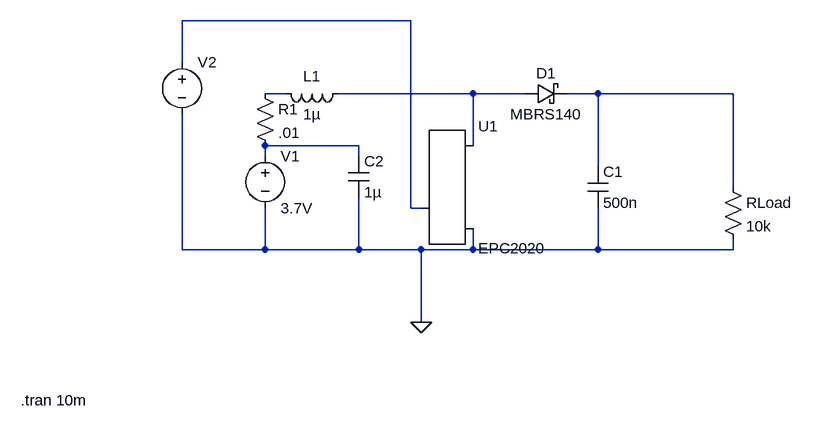
[diagram p0: schematic EPC2020-Boost.asc]
EPC2020-Boost.asc, the LTspice schematic file:
Version 4
SHEET 1 880 680
WIRE 80 -48 -272 -48
WIRE -272 16 -272 -48
WIRE -112 64 -144 64
WIRE 176 64 -32 64
WIRE 256 64 176 64
WIRE 368 64 320 64
WIRE 576 64 368 64
WIRE 0 144 -144 144
WIRE 176 144 176 64
WIRE -144 160 -144 144
WIRE 0 160 0 144
WIRE 368 176 368 64
WIRE 576 208 576 64
WIRE 80 240 80 -48
WIRE 96 240 80 240
WIRE -272 304 -272 96
WIRE -144 304 -144 240
WIRE -144 304 -272 304
WIRE 0 304 0 224
WIRE 0 304 -144 304
WIRE 96 304 0 304
WIRE 176 304 176 272
WIRE 176 304 96 304
WIRE 368 304 368 240
WIRE 368 304 176 304
WIRE 576 304 576 288
WIRE 576 304 368 304
WIRE 96 416 96 304
FLAG 96 416 0
SYMBOL cap 352 176 R0
SYMATTR InstName C1
SYMATTR Value 500n
SYMBOL cap -16 160 R0
SYMATTR InstName C2
SYMATTR Value 1µ
SYMBOL EPCGaN 96 240 R0
SYMATTR InstName U1
SYMATTR Value EPC2020
SYMBOL voltage -144 144 R0
WINDOW 123 0 0 Left 0
WINDOW 39 0 0 Left 0
SYMATTR InstName V1
SYMATTR Value 3.7V
SYMBOL ind -16 48 R90
WINDOW 0 5 56 VBottom 2
WINDOW 3 32 56 VTop 2
SYMATTR InstName L1
SYMATTR Value 1µ
SYMBOL schottky 256 80 R270
WINDOW 0 32 32 VTop 2
WINDOW 3 0 32 VBottom 2
SYMATTR InstName D1
SYMATTR Value MBRS140
SYMATTR Description Diode
SYMATTR Type diode
SYMBOL voltage -272 0 R0
WINDOW 123 0 0 Left 0
WINDOW 39 0 0 Left 0
WINDOW 3 24 96 Invisible 2
SYMATTR Value PULSE(0 3.7 0 0 0 0.000000032 0.00001 10000000)
SYMATTR InstName V2
SYMBOL res 560 192 R0
SYMATTR InstName RLoad
SYMATTR Value 10k
SYMBOL res -160 48 R0
SYMATTR InstName R1
SYMATTR Value .01
TEXT -520 536 Left 2 !.tran 10m

The netlist it stands for:
* EPC2020-Boost.asc
C1 N004 0 500n
C2 N005 0 1µ
XU1 N001 N003 0 EPC2020
V1 N005 0 3.7V
L1 N003 N002 1µ
D1 N003 N004 MBRS140
V2 N001 0 PULSE(0 3.7 0 0 0 0.000000032 0.00001 10000000)
RLoad N004 0 10k
R1 N002 N005 .01
.model D D
.lib standard.dio
.tran 10m
.backanno
.end